# Altium schematic sheet ADS1115.SchDoc
size A4
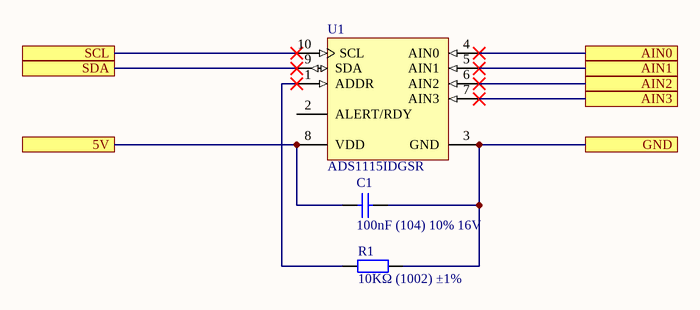
[diagram p0: ADS1115.SchDoc]

## Parts
C1  100nF (104) 10% 16V  [0402_C]
R1  10KΩ (1002) ±1%  [0402_R]
U1  ADS1115IDGSR  [TI-DGS10_M]

## Ports
5V, AIN0, AIN1, AIN2, AIN3, GND, SCL, SDA

## Nets
5V: C1.1 U1.8(VDD) ; port 5V
AIN0: U1.4(AIN0) ; port AIN0
AIN1: U1.5(AIN1) ; port AIN1
AIN2: U1.6(AIN2) ; port AIN2
AIN3: U1.7(AIN3) ; port AIN3
GND: C1.2 R1.2 U1.3(GND) ; port GND
SCL: U1.10(SCL) ; port SCL
SDA: U1.9(SDA) ; port SDA
NetR1_1: R1.1 U1.1(ADDR)

Not connected (* = marked no-connect by the designer): U1 2(ALERT/RDY)

## Library data of the parts
C1 = 0402 100nF (104) 10% 16V: 贴片电容; ComponentLink1Description: 供应商链接; ComponentLink1URL: http://www.szlcsc.com/product/details_1877.html; Package: 0402; Supplier: LC; SuppliersPartNumber: C1525
R1 = 0402 10KΩ (1002) 1%: 贴片电阻; ComponentLink1Description: 供应商链接; ComponentLink1URL: http://www.szlcsc.com/product/details_26487.html; Package: 0402; Supplier: LC; SuppliersPartNumber: C25744
U1 = ADS1115IDGSR: 16-Bit ADC with Integrated Multiplexer, PGA, Comparator, Oscillator, and Reference, -40 to 125 degC, 10-pin SOP (DGS10), Green (RoHS & no Sb/Br); Manufacturer: Texas Instruments; # Input Channels: 4; Analog Voltage AV/DD(Max)(V): 5.5; Analog Voltage AV/DD(Min)(V): 2; Architecture: Delta-Sigma; INL(Max)(+/-LSB): 1; Interface: Serial I2C; Resolution(Bits): 16; Sample Rate (max)(SPS): 860; SubFamily: Precision ADC (<=10MSPS); DatasheetVersion: SBAS444B; PackageVersion: 4073272/C, 02/2004; PackageReference: DGS10; PackageDescription: 10-Pin Plastic Small Outline, Body 3 x 3 mm, Pitch 0.5 mm; Supplier 1: Digi-Key; Supplier Part Number 1: 296-13060-2-ND; Supplier 2: Digi-Key; Supplier Part Number 2: 296-13060-1-ND; Supplier 3: Digi-Key; Supplier Part Number 3: 296-13060-6-ND; Supplier 4: Newark; Supplier Part Number 4: 74C7007; Supplier 5: Mouser; Supplier Part Number 5: 595-ADS1253E/2K5; Digital Supply(Max)(V): 5.5; Digital Supply(Min)(V): 2; Eco-Plan: Green (RoHS & no Sb/Br); Mounting Technology: Surface Mount; Code_JEDEC: MO-153; PartNumber: ADS1115IDGSR; ComponentLink1Description: Manufacturer URL; ComponentLink1URL: http://www.ti.com/; ComponentLink2Description: Datasheet; ComponentLink2URL: http://www.ti.com/general/docs/lit/getliterature.tsp?genericPartNumber=ADS1115&fileType=pdf; ComponentLink3Description: Package Specification; ComponentLink3URL: http://www.ti.com/lit/ml/mpds035b/mpds035b.pdf